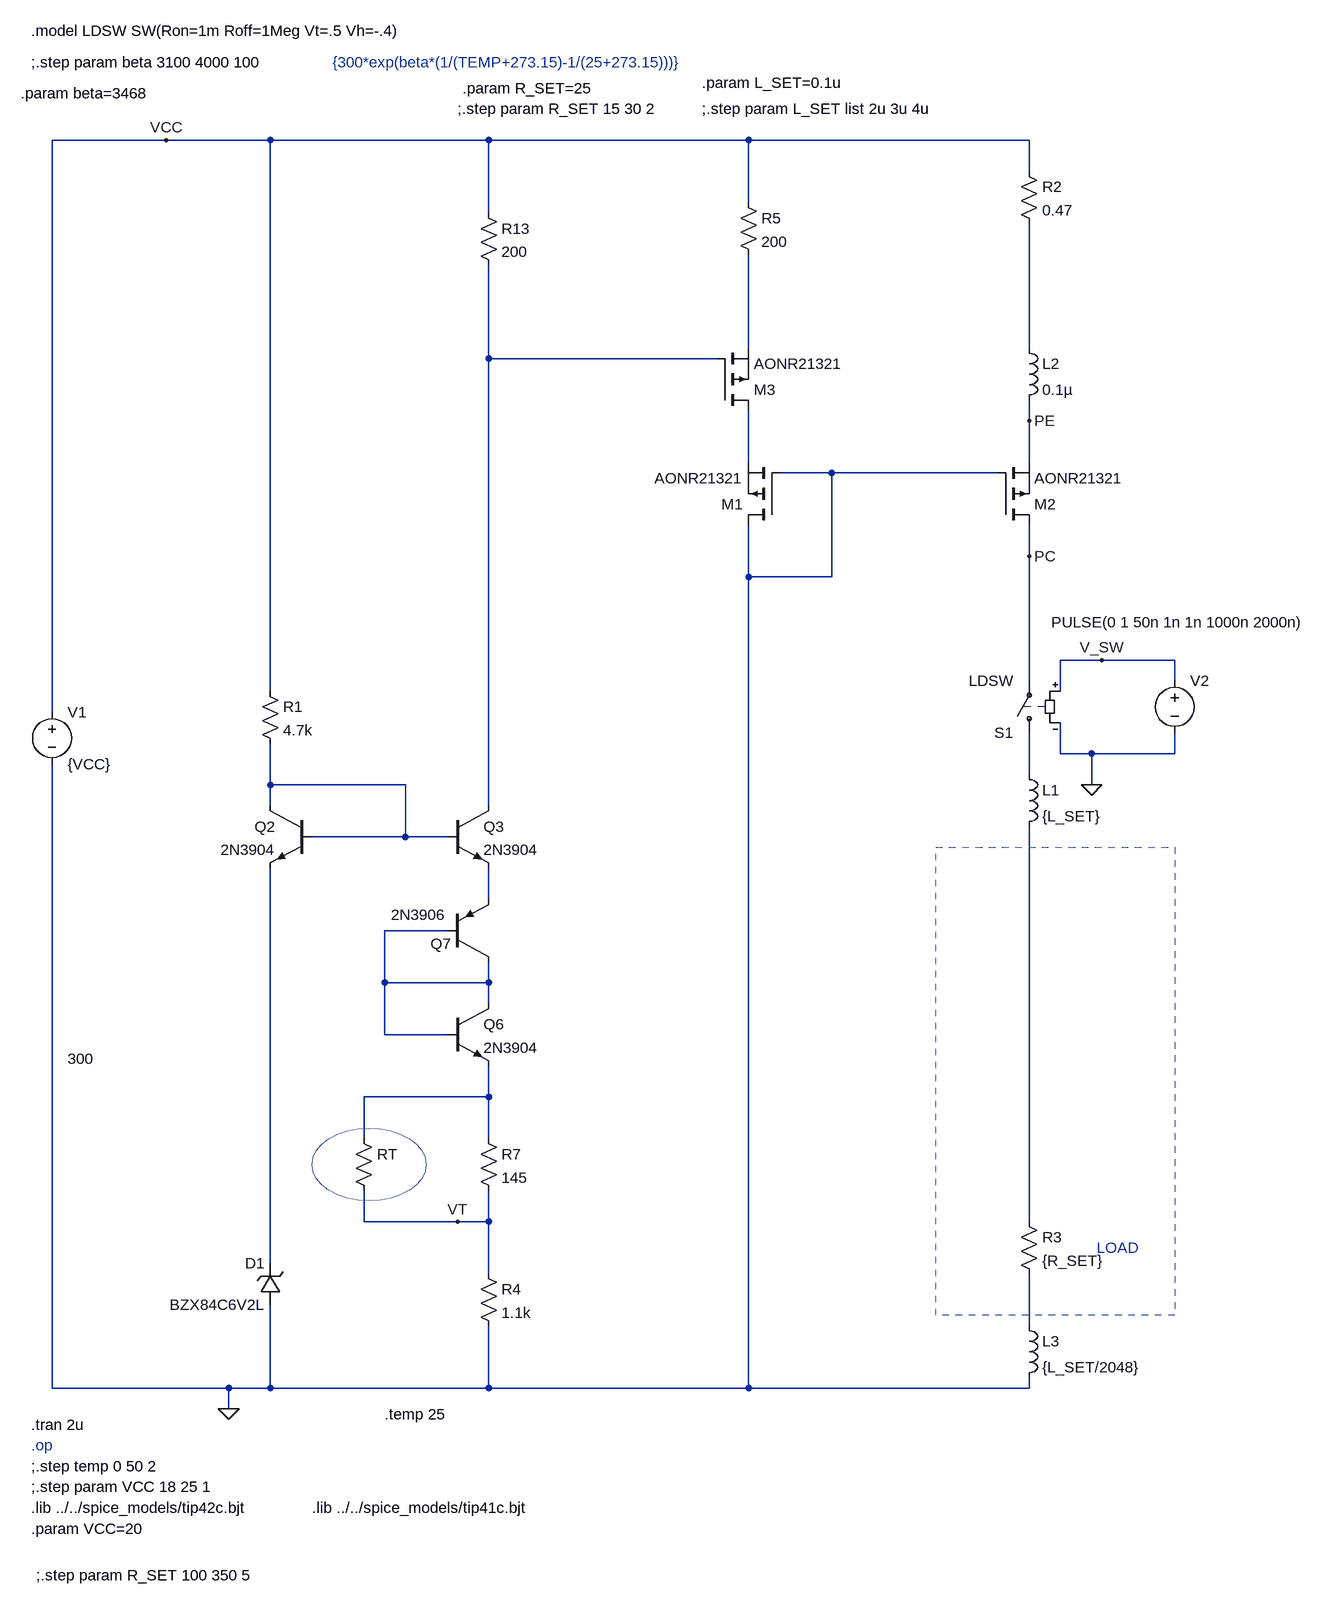
[diagram p0: schematic current_source_mos.asc]
current_source_mos.asc, the LTspice schematic file:
Version 4
SHEET 1 4220 1216
WIRE -528 -1328 -704 -1328
WIRE -368 -1328 -528 -1328
WIRE -32 -1328 -368 -1328
WIRE 368 -1328 -32 -1328
WIRE 800 -1328 368 -1328
WIRE 800 -1280 800 -1328
WIRE 368 -1232 368 -1328
WIRE -32 -1216 -32 -1328
WIRE 368 -1008 368 -1152
WIRE 800 -1008 800 -1200
WIRE -32 -992 -32 -1136
WIRE 320 -992 -32 -992
WIRE 800 -896 800 -928
WIRE 368 -832 368 -912
WIRE 800 -832 800 -896
WIRE 496 -816 416 -816
WIRE 752 -816 496 -816
WIRE 800 -688 800 -736
WIRE 368 -656 368 -736
WIRE 496 -656 496 -816
WIRE 496 -656 368 -656
WIRE 912 -528 848 -528
WIRE 1024 -528 912 -528
WIRE 800 -496 800 -688
WIRE 1024 -496 1024 -528
WIRE -368 -480 -368 -1328
WIRE 848 -480 848 -528
WIRE -704 -448 -704 -1328
WIRE 848 -384 848 -432
WIRE 896 -384 848 -384
WIRE 1024 -384 1024 -416
WIRE 1024 -384 896 -384
WIRE 800 -352 800 -416
WIRE -368 -336 -368 -400
WIRE -160 -336 -368 -336
WIRE 896 -336 896 -384
WIRE -368 -304 -368 -336
WIRE -32 -304 -32 -992
WIRE -160 -256 -160 -336
WIRE -160 -256 -304 -256
WIRE -96 -256 -160 -256
WIRE -32 -160 -32 -208
WIRE -96 -112 -192 -112
WIRE -192 -32 -192 -112
WIRE -32 -32 -32 -64
WIRE -32 -32 -192 -32
WIRE -32 0 -32 -32
WIRE -192 48 -192 -32
WIRE -96 48 -192 48
WIRE -32 144 -32 96
WIRE -32 144 -224 144
WIRE -224 208 -224 144
WIRE -32 208 -32 144
WIRE -224 336 -224 288
WIRE -80 336 -224 336
WIRE -32 336 -32 288
WIRE -32 336 -80 336
WIRE 800 336 800 -272
WIRE -368 400 -368 -208
WIRE -32 416 -32 336
WIRE 800 496 800 416
WIRE -704 592 -704 -368
WIRE -432 592 -704 592
WIRE -368 592 -368 464
WIRE -368 592 -432 592
WIRE -32 592 -32 496
WIRE -32 592 -368 592
WIRE 368 592 368 -656
WIRE 368 592 -32 592
WIRE 800 592 800 576
WIRE 800 592 368 592
WIRE -432 624 -432 592
FLAG -432 624 0
FLAG 800 -896 PE
FLAG 800 -688 PC
FLAG -80 336 VT
FLAG -528 -1328 VCC
FLAG 896 -336 0
FLAG 912 -528 V_SW
SYMBOL npn -304 -304 M0
SYMATTR InstName Q2
SYMATTR Value 2N3904
SYMBOL zener -352 464 R180
WINDOW 0 24 64 Left 2
WINDOW 3 24 0 Left 2
SYMATTR InstName D1
SYMATTR Value BZX84C6V2L
SYMBOL res -384 -496 R0
SYMATTR InstName R1
SYMATTR Value 4.7k
SYMBOL res 784 -1296 R0
SYMATTR InstName R2
SYMATTR Value 0.47
SYMBOL res 784 320 R0
SYMATTR InstName R3
SYMATTR Value {R_SET}
SYMBOL voltage -704 -464 R0
SYMATTR InstName V1
SYMATTR Value {VCC}
SYMBOL npn -96 -304 R0
SYMATTR InstName Q3
SYMATTR Value 2N3904
SYMBOL res -48 400 R0
SYMATTR InstName R4
SYMATTR Value 1.1k
SYMBOL pnp -96 -64 M180
WINDOW 0 -25 28 Left 2
WINDOW 3 -86 72 Left 2
SYMATTR InstName Q7
SYMATTR Value 2N3906
SYMBOL npn -96 0 R0
SYMATTR InstName Q6
SYMATTR Value 2N3904
SYMBOL res -48 192 R0
SYMATTR InstName R7
SYMATTR Value 145
SYMBOL res -48 -1232 R0
SYMATTR InstName R13
SYMATTR Value 200
SYMBOL res -240 192 R0
WINDOW 3 -440 -107 Left 2
SYMATTR Value 300
SYMATTR InstName RT
SYMBOL sw 800 -400 R180
SYMATTR InstName S1
SYMATTR Value LDSW
SYMBOL voltage 1024 -512 R0
WINDOW 123 0 0 Left 0
WINDOW 39 0 0 Left 0
WINDOW 3 -190 -74 Left 2
SYMATTR Value PULSE(0 1 50n 1n 1n 1000n 2000n)
SYMATTR InstName V2
SYMBOL ind 784 -368 R0
SYMATTR InstName L1
SYMATTR Value {L_SET}
SYMBOL ind 784 -1024 R0
SYMATTR InstName L2
SYMATTR Value 0.1µ
SYMBOL ind 784 480 R0
SYMATTR InstName L3
SYMATTR Value {L_SET/2048}
SYMBOL pmos 416 -736 R180
SYMATTR InstName M1
SYMATTR Value AONR21321
SYMBOL pmos 752 -736 M180
SYMATTR InstName M2
SYMATTR Value AONR21321
SYMBOL res 352 -1248 R0
SYMATTR InstName R5
SYMATTR Value 200
SYMBOL pmos 320 -912 M180
SYMATTR InstName M3
SYMATTR Value AONR21321
TEXT -736 648 Left 2 !.tran 2u
TEXT -736 712 Left 2 !;.step temp 0 50 2
TEXT 904 376 Left 2 ;LOAD
TEXT -736 680 Left 2 ;.op
TEXT -72 -1408 Left 2 !.param R_SET=25
TEXT -736 744 Left 2 !;.step param VCC 18 25 1
TEXT -736 776 Left 2 !.lib ../../spice_models/tip42c.bjt
TEXT -736 808 Left 2 !.param VCC=20
TEXT -728 880 Left 2 !;.step param R_SET 100 350 5
TEXT -752 -1400 Left 2 !.param beta=3468
TEXT -736 -1448 Left 2 !;.step param beta 3100 4000 100
TEXT -272 -1448 Left 2 ;{300*exp(beta*(1/(TEMP+273.15)-1/(25+273.15)))}
TEXT -80 -1376 Left 2 !;.step param R_SET 15 30 2
TEXT -736 -1496 Left 2 !.model LDSW SW(Ron=1m Roff=1Meg Vt=.5 Vh=-.4)
TEXT -192 632 Left 2 !.temp 25
TEXT 296 -1376 Left 2 !;.step param L_SET list 2u 3u 4u
TEXT -304 776 Left 2 !.lib ../../spice_models/tip41c.bjt
TEXT 296 -1416 Left 2 !.param L_SET=0.1u
RECTANGLE Normal 1024 480 656 -240 2
CIRCLE Normal -128 304 -304 192 2

The netlist it stands for:
* current_source_mos.asc
Q2 N006 N006 N011 0 2N3904
D1 0 N011 BZX84C6V2L
R1 VCC N006 4.7k
R2 VCC N002 0.47
R3 N010 N012 {R_SET}
V1 VCC 0 {VCC}
Q3 N003 N006 N007 0 2N3904
R4 VT 0 1.1k
Q7 N008 N008 N007 0 2N3906
Q6 N008 N008 N009 0 2N3904
R7 N009 VT 145
R13 VCC N003 200
RT N009 VT 300
S1 N005 PC V_SW 0 LDSW
V2 V_SW 0 PULSE(0 1 50n 1n 1n 1000n 2000n)
L1 N005 N010 {L_SET}
L2 N002 PE 0.1µ
L3 N012 0 {L_SET/2048}
M1 0 0 N004 N004 AONR21321
M2 PC 0 PE PE AONR21321
R5 VCC N001 200
M3 N004 N003 N001 N001 AONR21321
.model D D
.lib standard.dio
.model NPN NPN
.model PNP PNP
.lib standard.bjt
.model NMOS NMOS
.model PMOS PMOS
.lib standard.mos
.tran 2u
;.step temp 0 50 2
* LOAD
* .op
.param R_SET=25
;.step param VCC 18 25 1
.lib ../../spice_models/tip42c.bjt
.param VCC=20
;.step param R_SET 100 350 5
.param beta=3468
;.step param beta 3100 4000 100
* {300*exp(beta*(1/(TEMP+273.15)-1/(25+273.15)))}
;.step param R_SET 15 30 2
.model LDSW SW(Ron=1m Roff=1Meg Vt=.5 Vh=-.4)
.temp 25
;.step param L_SET list 2u 3u 4u
.lib ../../spice_models/tip41c.bjt
.param L_SET=0.1u
.backanno
.end